# EAGLE design pc_sensything_v1 (EAGLE 6.6.0)

## Sheet 1 of 2
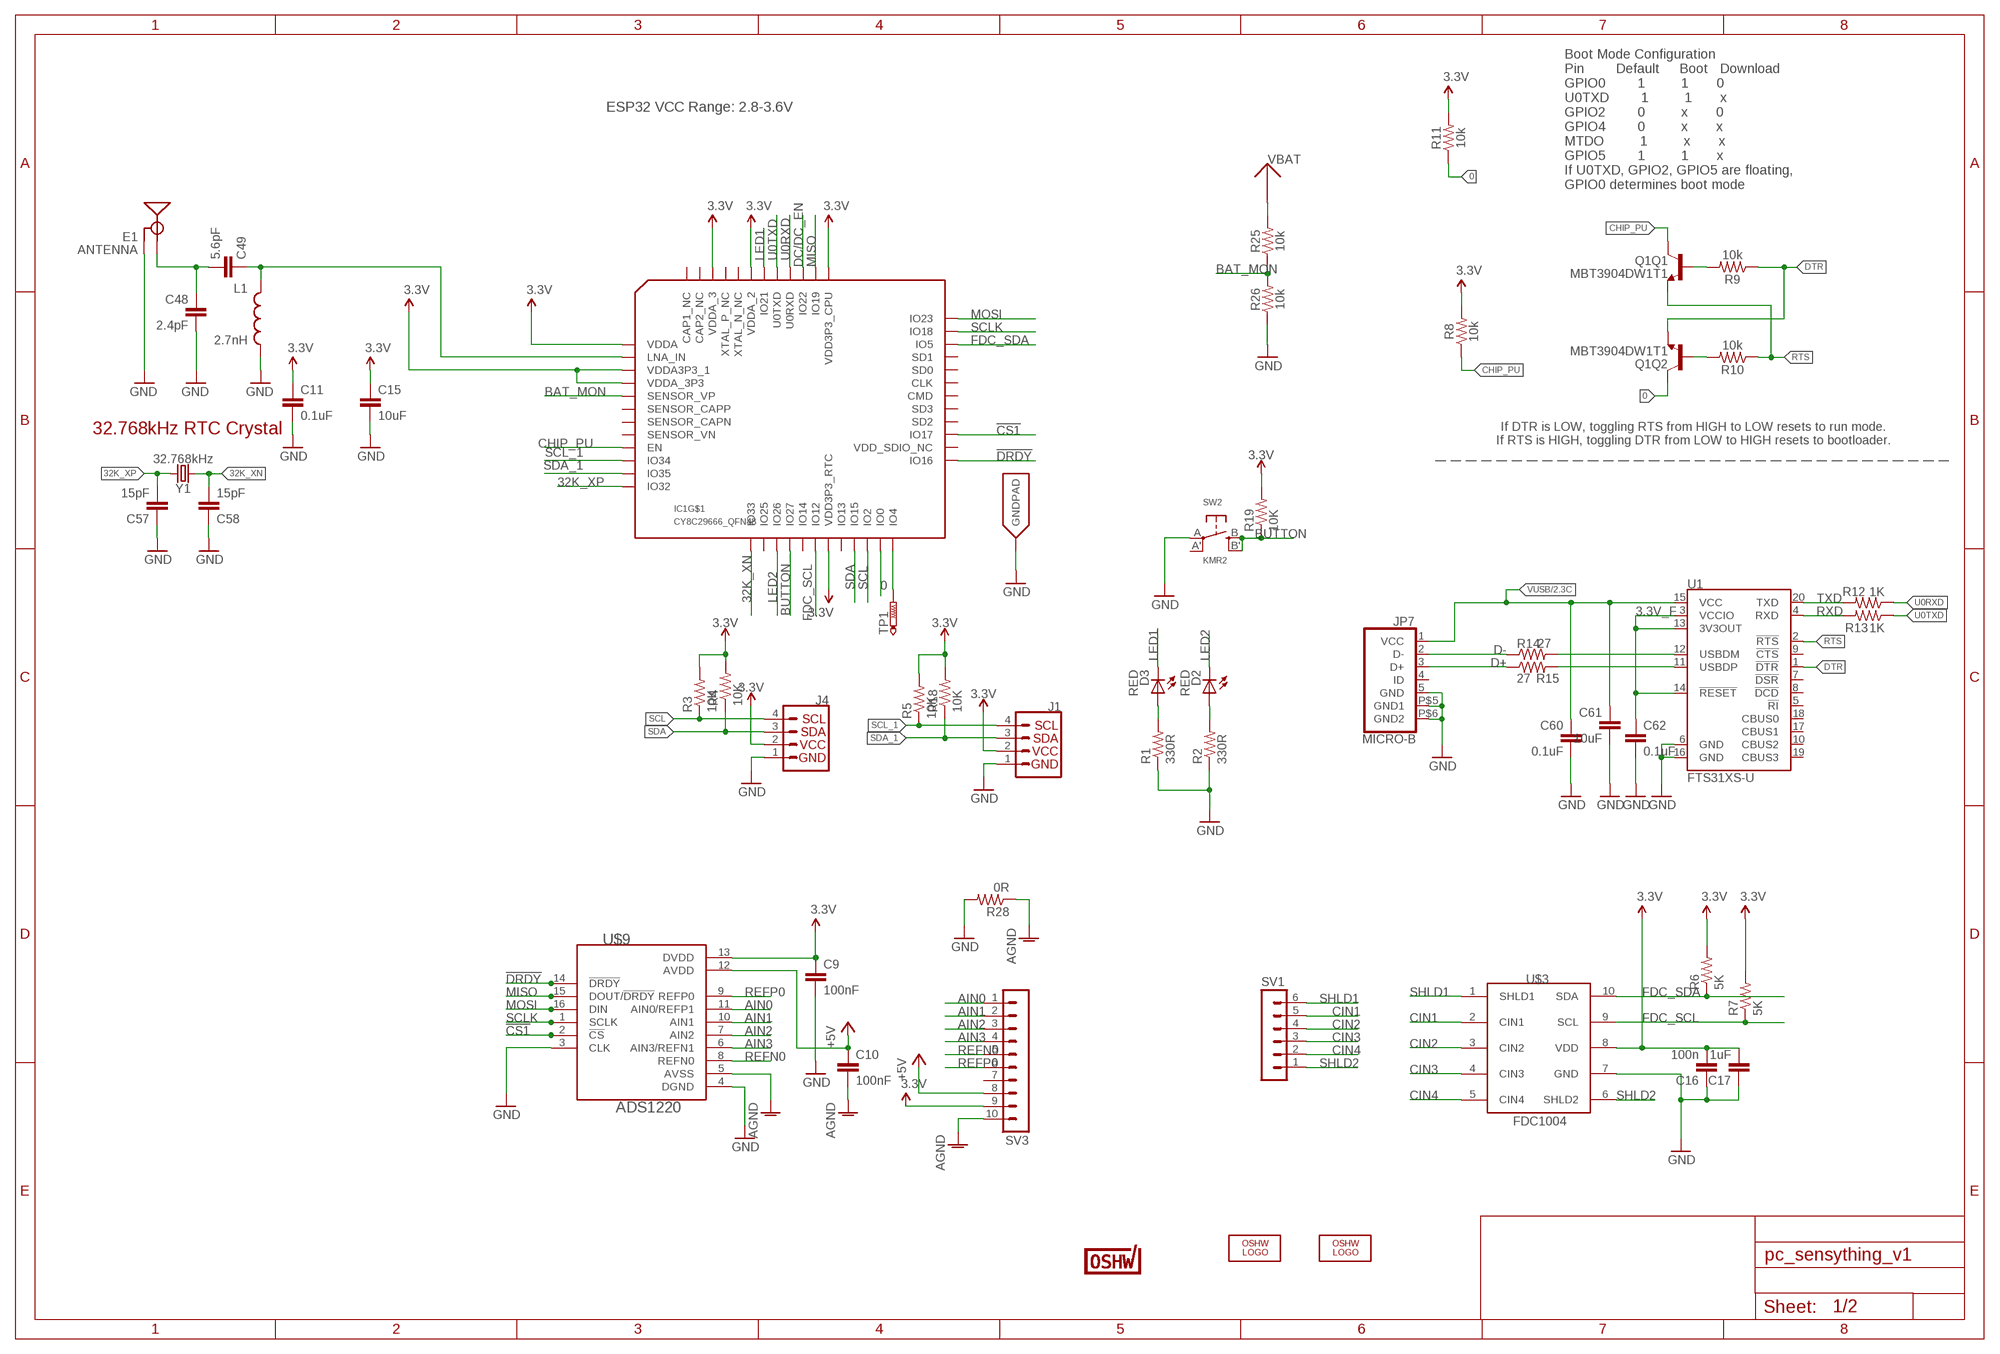
[diagram p0: schematic, sheet 1]

### Parts
C9  100nF  C-EUC0805  [C0805]
C10  100nF  C-EUC0805  [C0805]
C11  0.1uF  0.1UF-0603-25V-(+80/-20%)  [0603]
C15  10uF  10UF-0603-6.3V-20%  [0603]
C16  100n  C-EUC0805  [C0805]
C17  1uF  C-EUC0805  [C0805]
C48  2.4pF  2.4PF-0603-50V-5%  [0603]
C49  5.6pF  5.6PF-50V-5%(0603)  [0603]
C57  15pF  15PF-0603-50V-5%  [0603]
C58  15pF  15PF-0603-50V-5%  [0603]
C60  0.1uF  C-EUC0402  [C0402]
C61  10uF  C-EUC0805  [C0805]
C62  0.1uF  C-EUC0402  [C0402]
D2  RED  LEDCHIPLED_0603  [CHIPLED_0603]
D3  RED  LEDCHIPLED_0603  [CHIPLED_0603]
E1  ANTENNA  ANTENNATRACE-TUNED  [TRACE_ANTENNA_2.4GHZ_25.7MM_TUNED]
IC1  CY8C29666_QFN48  [QFN48]
J1  QWIIC_CONNECTORJS-1MM  [1X04_1MM_RA]
J4  QWIIC_CONNECTORJS-1MM  [1X04_1MM_RA]
JP7  MICRO-B  [MICRO-B]
L1  2.7nH  INDUCTOR0603  [0603]
LOGO2  OSHW_LOGO_FILLX0200-NT  [OSHW_FILLX200_NOTEXT]
LOGO3  OSHW_LOGO_FILLX0200-NT  [OSHW_FILLX200_NOTEXT]
Q1  MBT3904DW1T1  [SC70-6]
R1  330R  R-US_R0402  [R0402]
R2  330R  R-US_R0402  [R0402]
R3  10K  R-US_R0402  [R0402]
R4  10K  R-US_R0402  [R0402]
R5  10K  R-US_R0402  [R0402]
R6  5K  R-US_R0805  [R0805]
R7  5K  R-US_R0805  [R0805]
R8  10k  10KOHM-1/10W-1%(0603)0603  [0603]
R9  10k  10KOHM-0603-1/10W-1%  [0603]
R10  10k  10KOHM-0603-1/10W-1%  [0603]
R11  10k  10KOHM-1/10W-1%(0603)0603  [0603]
R12  1K  R-US_R0402  [R0402]
R13  1K  R-US_R0402  [R0402]
R14  27  R-US_R0402  [R0402]
R15  27  R-US_R0402  [R0402]
R18  10K  R-US_R0402  [R0402]
R19  10K  R-US_R0402  [R0402]
R25  10k  10KOHM-1/10W-1%(0603)0603  [0603]
R26  10k  10KOHM-1/10W-1%(0603)0603  [0603]
R28  0R  R-US_R0805  [R0805]
SV1  MA06-1  [MA06-1]
SV3  MA10-1  [MA10-1]
SW2  KMR2  SWITCH_TACT_SMT4.6X2.8  [BTN_KMR2_4.6X2.8]
TP1  PTR1TP10SQ  [TP10SQ]
U1  FTS31XS-U  FT231XS  [SSOP20_L]
U$3  FDC1004  [VSSOP-10]
U$9  ADS1220  [TSSOP-16]
U$22  CERT-SMALL  [CERT-SMALL-SILK]
Y1  32.768kHz  CRYSTAL-32.768KHZSMD-3.2X1.5  [CRYSTAL-SMD-3.2X1.5MM]

### Nets
0: IC1.23(IO0) Q1.6(Q2:C) R11.1
3.3V: C9.1 C11.1 C15.1 C16.2 C17.2 IC1.1(VDDA) IC1.3(VDDA3P3_1) IC1.4(VDDA_3P3) IC1.19(VDD3P3_RTC) IC1.37(VDD3P3_CPU) IC1.43(VDDA_2) IC1.46(VDDA_3) J1.2 J4.2 R3.2 R4.2 R5.2 R6.2 R7.2 R8.2 R11.2 R18.2 R19.2 SV3.9 U$3.8(VDD) U$9.13(DVDD) ; also sheet 2
3.3V_F: C62.1 U1.3(VCCIO) U1.13(3V3OUT) U1.14(!RESET)
32K_XN: C58.2 IC1.13(IO33) Y1.P$2
32K_XP: C57.2 IC1.12(IO32) Y1.P$1
!CS1: IC1.27(IO17) U$9.2(!CS)
!DRDY: IC1.25(IO16) U$9.14(!DRDY)
+5V: C10.1 SV3.8 U$9.12(AVDD) ; also sheet 2
AGND: C10.2 R28.1 SV3.10 U$9.5(AVSS)
AIN0: SV3.1 U$9.11(AIN0/REFP1)
AIN1: SV3.2 U$9.10(AIN1)
AIN2: SV3.3 U$9.7(AIN2)
AIN3: SV3.4 U$9.6(AIN3/REFN1)
BAT_MON: IC1.5(SENSOR_VP) R25.1 R26.2
BUTTON: IC1.16(IO27) R19.1 SW2.B'(S1) SW2.B(S)
CHIP_PU: IC1.9(EN) Q1.3(Q1:C) R8.1
CIN1: SV1.5 U$3.2(CIN1)
CIN2: SV1.4 U$3.3(CIN2)
CIN3: SV1.3 U$3.4(CIN3)
CIN4: SV1.2 U$3.5(CIN4)
D+: JP7.3(D+) R15.1
D-: JP7.2(D-) R14.1
DC/DC_EN: IC1.39(IO22) ; also sheet 2
DTR: Q1.1(Q2:E) R9.1 U1.1(!DTR)
FDC_SCL: IC1.18(IO12) R7.1 U$3.9(SCL)
FDC_SDA: IC1.34(IO5) R6.1 U$3.10(SDA)
GND: C9.2 C11.2 C15.2 C16.1 C17.1 C48.2 C57.1 C58.1 C60.2 C61.2 C62.2 E1.GND E1.GND2(GND) IC1.EXP(GNDPAD) J1.1 J4.1 JP7.5(GND) JP7.P$5(GND1) JP7.P$6(GND2) L1.2 R1.1 R2.1 R26.1 R28.2 SW2.A(P) U1.6(GND) U1.16(GND) U$3.7(GND) U$9.3(CLK) U$9.4(DGND) ; also sheet 2
LED1: D3.C IC1.42(IO21)
LED2: D2.C IC1.15(IO26)
LNA_IN: C49.1 IC1.2(LNA_IN) L1.1
MISO: IC1.38(IO19) U$9.15(DOUT/!DRDY)
MOSI: IC1.36(IO23) U$9.16(DIN)
N$3: D3.A R1.2
N$4: Q1.5(Q1:B) R9.2
N$5: D2.A R2.2
N$8: IC1.24(IO4) TP1.TP
N$9: Q1.2(Q2:B) R10.2
N$20: R14.2 U1.12(USBDM)
N$21: R15.2 U1.11(USBDP)
REFN0: SV3.5 U$9.8(REFN0)
REFP0: SV3.6 U$9.9(REFP0)
RTS: Q1.4(Q1:E) R10.1 U1.2(!RTS)
RXD: R13.2 U1.4(RXD)
SCL: IC1.22(IO2) J4.4 R3.1
SCL_1: IC1.10(IO34) J1.4 R5.1
SCLK: IC1.35(IO18) U$9.1(SCLK)
SDA: IC1.21(IO15) J4.3 R4.1
SDA_1: IC1.11(IO35) J1.3 R18.1
SHLD1: SV1.6 U$3.1(SHLD1)
SHLD2: SV1.1 U$3.6(SHLD2)
TRACE_ANT2: C48.1 C49.2 E1.ANT(SIGNAL)
TXD: R12.2 U1.20(TXD)
U0RXD: IC1.40(U0RXD) R12.1
U0TXD: IC1.41(U0TXD) R13.1
VBAT: R25.2 ; also sheet 2
VUSB: C60.1 C61.1 JP7.1(VCC) U1.15(VCC) ; also sheet 2
Unconnected: IC1.6(SENSOR_CAPP) IC1.8(SENSOR_VN) IC1.14(IO25) IC1.17(IO14) IC1.20(IO13) IC1.26(VDD_SDIO_NC) IC1.28(SD2) IC1.29(SD3) IC1.30(CMD) IC1.31(CLK) IC1.32(SD0) IC1.33(SD1) IC1.44(XTAL_N_NC) IC1.45(XTAL_P_NC) IC1.47(CAP2_NC) IC1.48(CAP1_NC) JP7.4(ID) SV3.7 SW2.A'(P1) U1.5(!RI) U1.7(!DSR) U1.8(!DCD) U1.9(!CTS) U1.10(CBUS2) U1.17(CBUS1) U1.18(CBUS0) U1.19(CBUS3)

### Notes on the sheet
- ESP32 VCC Range: 2.8-3.6V
- Boot Mode Configuration
  Pin        Default     Boot   Download
  GPIO0        1         1       0
  U0TXD        1         1       x
  GPIO2        0         x       0
  GPIO4        0         x       x
  MTDO         1         x       x
  GPIO5        1         1       x
  If U0TXD, GPIO2, GPIO5 are floating, 
  GPIO0 determines boot mode
- 32.768kHz RTC Crystal
- If DTR is LOW, toggling RTS from HIGH to LOW resets to run mode.
  If RTS is HIGH, toggling DTR from LOW to HIGH resets to bootloader.

## Sheet 2 of 2
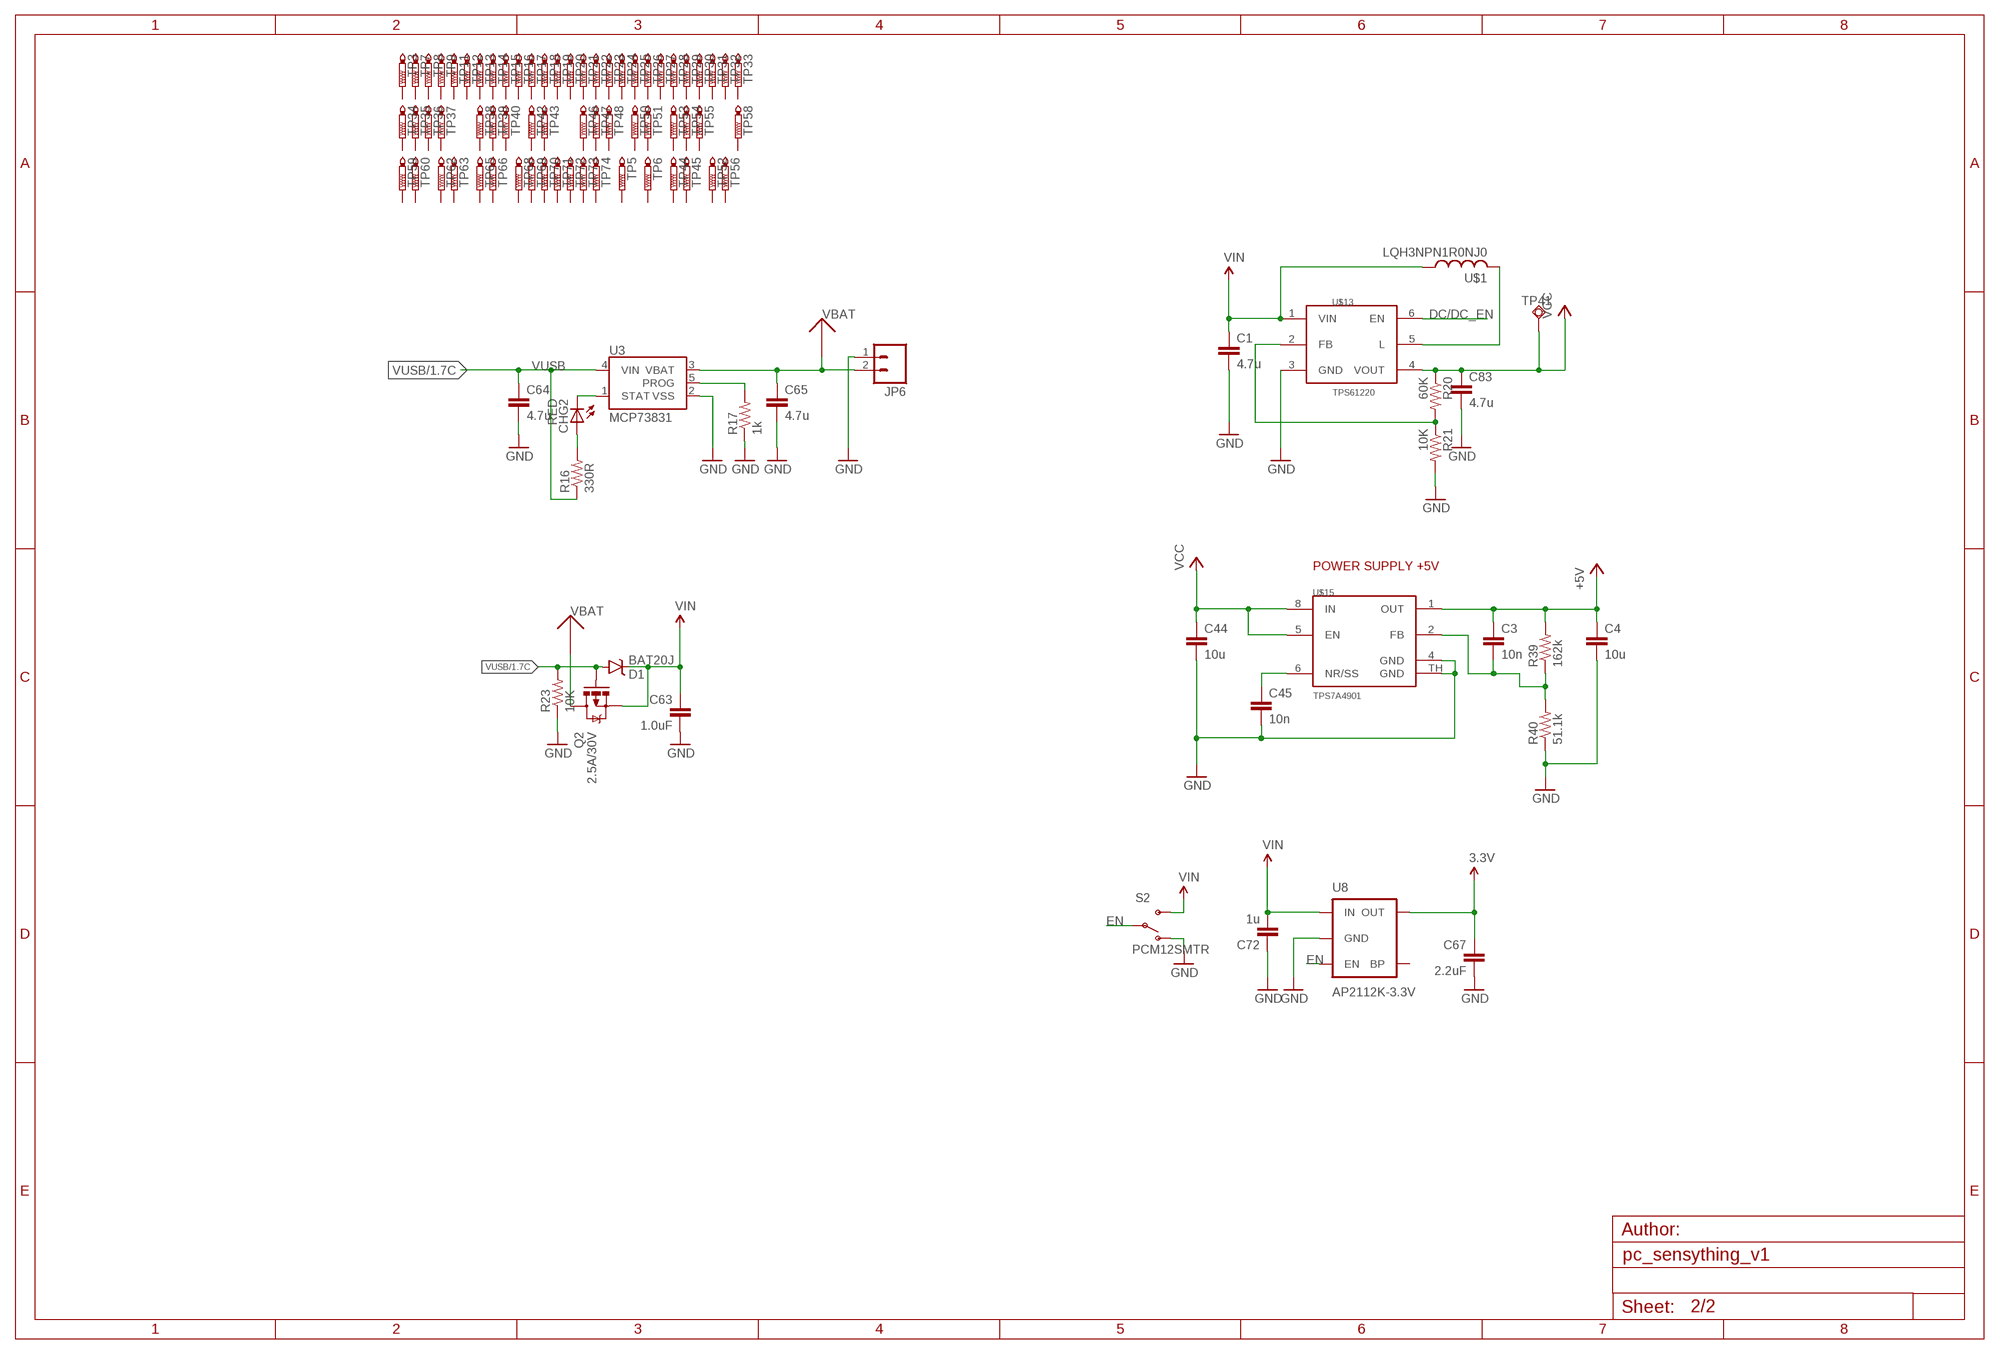
[diagram p1: schematic, sheet 2]

### Parts
C1  4.7u  C-EUC0805  [C0805]
C3  10n  C-EUC0402  [C0402]
C4  10u  C-EUC0805  [C0805]
C44  10u  C-EUC0805  [C0805]
C45  10n  C-EUC0402  [C0402]
C63  1.0uF  C-EUC0402  [C0402]
C64  4.7u  C-EUC0805  [C0805]
C65  4.7u  C-EUC0805  [C0805]
C67  2.2uF  C-EUC0402  [C0402]
C72  1u  C-EUC0402  [C0402]
C83  4.7u  C-EUC0805  [C0805]
CHG2  RED  LEDCHIPLED_0603  [CHIPLED_0603]
D1  BAT20J  DIODE-SCHOTTKY-BAT20J  [SOD-323]
JP6  M02-JST-2MM-SMT  [JST-2-SMD]
Q2  2.5A/30V  MOSFET-PCHANNELDMG2307L  [SOT23-3]
R16  330R  R-US_R0402  [R0402]
R17  1k  R-US_R0402  [R0402]
R20  60K  R-US_R0805  [R0805]
R21  10K  R-US_R0805  [R0805]
R23  10K  R-US_R0402  [R0402]
R39  162k  R-US_R0805  [R0805]
R40  51.1k  R-US_R0805  [R0805]
S2  PCM12SMTR  SWITCH-SPDT-SMD-A  [SWITCH-SPST-SMD-A]
TP3  PTR1PAD1-13  [P1-13]
TP5  PTR1PAD1-13  [P1-13]
TP6  PTR1PAD1-13  [P1-13]
TP7  PTR1PAD1-13  [P1-13]
TP8  PTR1PAD1-13  [P1-13]
TP9  PTR1PAD1-13  [P1-13]
TP11  PTR1PAD1-13  [P1-13]
TP12  PTR1PAD1-13  [P1-13]
TP13  PTR1PAD1-13  [P1-13]
TP14  PTR1PAD1-13  [P1-13]
TP15  PTR1PAD1-13  [P1-13]
TP16  PTR1PAD1-13  [P1-13]
TP17  PTR1PAD1-13  [P1-13]
TP18  PTR1PAD1-13  [P1-13]
TP19  PTR1PAD1-13  [P1-13]
TP20  PTR1PAD1-13  [P1-13]
TP21  PTR1PAD1-13  [P1-13]
TP22  PTR1PAD1-13  [P1-13]
TP23  PTR1PAD1-13  [P1-13]
TP24  PTR1PAD1-13  [P1-13]
TP25  PTR1PAD1-13  [P1-13]
TP26  PTR1PAD1-13  [P1-13]
TP27  PTR1PAD1-13  [P1-13]
TP28  PTR1PAD1-13  [P1-13]
TP29  PTR1PAD1-13  [P1-13]
TP30  PTR1PAD1-13  [P1-13]
TP31  PTR1PAD1-13  [P1-13]
TP32  PTR1PAD1-13  [P1-13]
TP33  PTR1PAD1-13  [P1-13]
TP34  PTR1PAD1-13  [P1-13]
TP35  PTR1PAD1-13  [P1-13]
TP36  PTR1PAD1-13  [P1-13]
TP37  PTR1PAD1-13  [P1-13]
TP38  PTR1PAD1-13  [P1-13]
TP39  PTR1PAD1-13  [P1-13]
TP40  PTR1PAD1-13  [P1-13]
TP41  TPSQB1,27  [B1,27]
TP42  PTR1PAD1-13  [P1-13]
TP43  PTR1PAD1-13  [P1-13]
TP44  PTR1PAD1-13  [P1-13]
TP45  PTR1PAD1-13  [P1-13]
TP46  PTR1PAD1-13  [P1-13]
TP47  PTR1PAD1-13  [P1-13]
TP48  PTR1PAD1-13  [P1-13]
TP50  PTR1PAD1-13  [P1-13]
TP51  PTR1PAD1-13  [P1-13]
TP52  PTR1PAD1-13  [P1-13]
TP53  PTR1PAD1-13  [P1-13]
TP54  PTR1PAD1-13  [P1-13]
TP55  PTR1PAD1-13  [P1-13]
TP56  PTR1PAD1-13  [P1-13]
TP58  PTR1PAD1-13  [P1-13]
TP59  PTR1PAD1-13  [P1-13]
TP60  PTR1PAD1-13  [P1-13]
TP62  PTR1PAD1-13  [P1-13]
TP63  PTR1PAD1-13  [P1-13]
TP65  PTR1PAD1-13  [P1-13]
TP66  PTR1PAD1-13  [P1-13]
TP68  PTR1PAD1-13  [P1-13]
TP69  PTR1PAD1-13  [P1-13]
TP70  PTR1PAD1-13  [P1-13]
TP71  PTR1PAD1-13  [P1-13]
TP72  PTR1PAD1-13  [P1-13]
TP73  PTR1PAD1-13  [P1-13]
TP74  PTR1PAD1-13  [P1-13]
U3  MCP73831  [SOT23-5]
U8  AP2112K-3.3V  V_REG_LDOSMD  [SOT23-5]
U$1  LQH3NPN1R0NJ0  [LQH3NP]
U$13  TPS61220  TPS61222  [SC-70-6]
U$15  TPS7A4901  [S-PDSO-G08]

### Nets
3.3V: C67.1 U8.5(OUT) ; also sheet 1
+5V: C3.1 C4.1 R39.2 U$15.1(OUT) ; also sheet 1
DC/DC_EN: U$13.6(EN) ; also sheet 1
EN: S2.2(P) U8.3(EN)
GND: C1.2 C4.2 C44.2 C45.2 C63.2 C64.2 C65.2 C67.2 C72.1 C83.2 JP6.1 R17.1 R21.2 R23.1 R40.1 S2.1(O) U3.2(VSS) U8.2(GND) U$13.3(GND) U$15.4(GND) U$15.TH(GND) ; also sheet 1
N$22: CHG2.C U3.1(STAT)
N$25: R20.2 R21.1 U$13.2(FB)
N$26: C45.1 U$15.6(NR/SS)
N$27: C3.2 R39.1 R40.2 U$15.2(FB)
N$29: CHG2.A R16.2
N$31: R17.2 U3.5(PROG)
N$39: U$1.P$2 U$13.5(L)
VBAT: C65.1 JP6.2 Q2.3(D) U3.3(VBAT) ; also sheet 1
VCC: C44.1 C83.1 R20.1 TP41.TP U$13.4(VOUT) U$15.5(EN) U$15.8(IN)
VIN: C1.1 C63.1 C72.2 D1.C Q2.2(S) S2.3(S) U8.1(IN) U$1.P$1 U$13.1(VIN)
VUSB: C64.1 D1.A Q2.1(G) R16.1 R23.2 U3.4(VIN) ; also sheet 1
Unconnected: TP3.TP TP5.TP TP6.TP TP7.TP TP8.TP TP9.TP TP11.TP TP12.TP TP13.TP TP14.TP TP15.TP TP16.TP TP17.TP TP18.TP TP19.TP TP20.TP TP21.TP TP22.TP TP23.TP TP24.TP TP25.TP TP26.TP TP27.TP TP28.TP TP29.TP TP30.TP TP31.TP TP32.TP TP33.TP TP34.TP TP35.TP TP36.TP TP37.TP TP38.TP TP39.TP TP40.TP TP42.TP TP43.TP TP44.TP TP45.TP TP46.TP TP47.TP TP48.TP TP50.TP TP51.TP TP52.TP TP53.TP TP54.TP TP55.TP TP56.TP TP58.TP TP59.TP TP60.TP TP62.TP TP63.TP TP65.TP TP66.TP TP68.TP TP69.TP TP70.TP TP71.TP TP72.TP TP73.TP TP74.TP U8.4(BP)

### Notes on the sheet
- POWER SUPPLY +5V

## Power pins joined to a net without a drawn wire
SENSOR_CAPN: IC1.7(SENSOR_CAPN)

## Library data of the parts
C1 C3 C4 C9 C10 C16 C17 C44 C45 C60-C65 C67 C72 C83 = rcl:C-EU: CAPACITOR, European symbol
C11 = SparkFun-Capacitors:0.1UF: 0.1µF ceramic capacitors A capacitor is a passive two-terminal electrical component used to store electrical energy temporarily in an electric field.; PROD_ID: CAP-00810
C15 = SparkFun-Capacitors:10UF: 10.0µF ceramic capacitors A capacitor is a passive two-terminal electrical component used to store electrical energy temporarily in an electric field.; PROD_ID: CAP-11015
C48 = esp32-thing-temp:2.4PF: 2.4pF ceramic capacitors A capacitor is a passive two-terminal electrical component used to store electrical energy temporarily in an electric field.; PROD_ID: CAP-13541
C49 = esp32-thing-temp:5.6PF-50V-5%(0603): CAP-12456; PROD_ID: CAP-12456
C57 C58 = SparkFun-Capacitors:15PF: 15pF ceramic capacitors A capacitor is a passive two-terminal electrical component used to store electrical energy temporarily in an electric field.; PROD_ID: CAP-07881
CHG2 D2 D3 = led:LED: LED OSRAM: - CHIPLED LG R971, LG N971, LY N971, LG Q971, LY Q971, LO R971, LY R971 LH N974, LH R974 LS Q976, LO Q976, LY Q976 LO Q996 - Hyper CHIPLED LW Q18S LB Q993, LB Q99A, LB R99A - SideLED LS A670, LO A670, LY A670, LG A670, LP A670 LB A673, LV A673, LT A673, LW A673 LH A674 LY A675 LS A676, LA A676, LO A676, LY A676, LW A676 LS A679, LY A679, LG A679 - Hyper Micro SIDELED® LS Y876, LA Y876, LO Y876, LY Y876 LT Y87S - SmartLED LW L88C, LW L88S LB L89C, LB L89S, LG L890 LS L89K, LO L89K, LY L89K LS L896, LA L896, LO L896, LY L896 - TOPLED LS T670, LO T670, LY T670, LG T670, LP T670 LSG T670, LSP T670, LSY T670, LOP T670, LYG T670 LG T671, LOG T671, LSG T671 LB T673, LV T673, LT T673, LW T673 LH T674 LS T676, LA T676, LO T676, LY T676, LB T676, LH T676, LSB T676, LW T676 LB T67C, LV T67C, LT T67C, LS T67K, LO T67K, LY T67K, LW E67C LS E67B, LA E67B, LO E67B, LY E67B, LB E67C, LV E67C, LT E67C LW T67C LS T679, LY T679, LG T679 LS T770, LO T770, LY T770, LG T770, LP T770 LB T773, LV T773, LT T773, LW T773 LH T774 LS E675, LA E675, LY E675, LS T675 LS T776, LA T776, LO T776, LY T776, LB T776 LHGB T686 LT T68C, LB T68C - Hyper Mini TOPLED® LB M676 - Mini TOPLED Santana® LG M470 LS M47K, LO M47K, LY M47K Source: http://www.osram.convergy.de LUXEON: - LUMILED® LXK2-PW12-R00, LXK2-PW12-S00, LXK2-PW14-U00, LXK2-PW14-V00 LXK2-PM12-R00, LXK2-PM12-S00, LXK2-PM14-U00 LXK2-PE12-Q00, LXK2-PE12-R00, LXK2-PE12-S00, LXK2-PE14-T00, LXK2-PE14-U00 LXK2-PB12-K00, LXK2-PB12-L00, LXK2-PB12-M00, LXK2-PB14-N00, LXK2-PB14-P00, LXK2-PB14-Q00 LXK2-PR12-L00, LXK2-PR12-M00, LXK2-PR14-Q00, LXK2-PR14-R00 LXK2-PD12-Q00, LXK2-PD12-R00, LXK2-PD12-S00 LXK2-PH12-R00, LXK2-PH12-S00 LXK2-PL12-P00, LXK2-PL12-Q00, LXK2-PL12-R00 Source: www.luxeon.com KINGBRIGHT: KA-3528ASYC Source: www.kingbright.com
D1 = SparkFun-DiscreteSemi:DIODE-SCHOTTKY: Schottky diodes in SFE's production catalog BAT20J 1A 23V 0.62Vf RB751 120mA 40V 0.37Vf PMEG4005EJ 0.5A 40V 0.42Vf MBRA140 1A 40V 0.5Vf B340A 3A 40V SMA; PROD_ID: DIO-11623
E1 = esp32-thing-temp:ANTENNA: Chip antenna Chip antenna with ground or secondary connection. Common with larger metal RF connectors.
IC1 = cypresspsoc_0.30:CY8C29666_QFN48
J1 J4 = SparkFun-Connectors:QWIIC_CONNECTOR: SparkFun I2C Standard Qwiic Connector An SMD 1mm pitch JST connector makes it easy and quick (get it? Qwiic?) to connect I2C devices to each other. The Qwiic system <http://www.sparkfun.com/qwiic> enables fast and solderless connection between popular platforms and various sensors and actuators. We carry 200mm <https://www.sparkfun.com/products/14204>, 100mm <https://www.sparkfun.com/products/14205>, 50mm <https://www.sparkfun.com/products/14206>, and breadboard friendly <https://www.sparkfun.com/products/14207> Qwiic cables. We also offer 10 pcs strips <https://www.sparkfun.com/products/14323> the SMD connectors.; PROD_ID: CONN-13694
JP6 = SparkFun:M02: Header 2 Standard 2-pin 0.1" header. Use with straight break away headers (SKU : PRT-00116), right angle break away headers (PRT-00553), swiss pins (PRT-00743), machine pins (PRT-00117), and female headers (PRT-00115). Molex polarized connector foot print use with SKU : PRT-08233 with associated crimp pins and housings.
JP7 = circuitects:MICRO-B
L1 = SparkFun-Passives:INDUCTOR: Inductors Basic Inductor/Choke - 0603 and 1206. Footprints are not proven and vary greatly between part numbers. INDUCTOR POWER 3.3UH 4.0A SMD 0.197" L x 0.197" W x 0.177" H (5.00mm x 5.00mm x 4.50mm); PROD_ID: NDUC-08762
LOGO2 LOGO3 = ohw-logo:OSHW_LOGO_FILL
Q1 = esp32-thing-temp:MBT3904DW1T1: MBT3904DW1 Dual NPN Transistors The MBT3904W1 puts two general purpose 3904 NPN transistors in a single package. Datasheet <http://www.onsemi.com/pub_link/Collateral/MBT3904DW1T1-D.PDF>; PROD_ID: TRANS-13337
Q2 = SparkFun-DiscreteSemi:MOSFET-PCHANNEL: Generic PMOSFET IRLML2244 - TRANS-11153 (SOT-23 -20V -4.3A) (1.Gate 2.Source 3.Drain) FQP27P06 - COM-10349 <http://www.sparkfun.com/products/10349> (TO-220 -60V -27A) (1.Gate 2.Source 3.Drain); PROD_ID: TRANS-11308
R1-R7 R12-R21 R23 R28 R39 R40 = rcl:R-US_: RESISTOR, American symbol
R8 R11 R25 R26 = SparkFun-Resistors:10KOHM-1/10W-1%(0603): RES-00824; PROD_ID: RES-00824; VALUE: 10K
R9 R10 = SparkFun-Resistors:10KOHM: 10kΩ resistor A resistor is a passive two-terminal electrical component that implements electrical resistance as a circuit element. Resistors act to reduce current flow, and, at the same time, act to lower voltage levels within circuits. - Wikipedia; PROD_ID: RES-00824
S2 = SparkFun-Electromechanical:SWITCH-SPDT: SPDT Switch Simple slide switch, Spark Fun Electronics SKU : COM-00102 DPDT SMT slide switch, AYZ0202, SWCH-08179; PROD_ID: SWCH-10651
SV1 = con-lstb:MA06-1: PIN HEADER; OC_FARNELL: unknown; OC_NEWARK: unknown
SV3 = con-lstb:MA10-1: PIN HEADER; OC_FARNELL: unknown; OC_NEWARK: unknown
SW2 = microbuilder:SWITCH_TACT_SMT: SMT Tact Switches 6x6mm - Digikey: P12940SCT-ND KMR2 (4.6x2.8mm) - Digikey: 401-1426-1-ND EVQ-PQHB55 - Light Touch, 160GF (4.5x4.5mm) - Digikey: P8090SCT-ND KMT0 - KMT021 NGJ LHS (etc.) IP68/Waterproof - Digikey: CKN10289CT-ND
TP1 TP3 TP5-TP9 TP11-TP40 TP42-TP48 TP50-TP56 TP58-TP60 TP62 TP63 TP65 TP66 TP68-TP74 = testpad:PTR1: TEST PIN
TP41 = testpad:TPSQ: Test pad
U1 = SparkFun-DigitalIC:FT231X: FTDI FT231X Full Speed USB to Full-handshake UART This USB2.0 Full Speed IC offers a compact bridge to full handshake UART interfaces. The device is a UART, capable of operating up to 3MBaud, with low power consumption (8mA). The FT231X includes the complete FT-X series feature set and enables USB to be added into a system design quickly and easily over a UART interface.; PROD_ID: IC-11524; VALUE: FT231XS
U3 = SparkFun:MCP73831: Microchip's MCP73831 Miniature single cell, fully integrated Li-Ion, Li-polymer charge management controller http://ww1.microchip.com/downloads/en/DeviceDoc/21984a.pdf
U8 = SparkFun-PowerIC:V_REG_LDO: Voltage Regulator LDO Standard 150mA LDO voltage regulator in SOT-23 layout. Micrel part MIC5205. BP (by-pass) pin is used to lower output noise with 470pF cap.; PROD_ID: VREG-12457
U$1 = circuitects:LQH3NPN1R0NJ0
U$3 = circuitects:FDC1004
U$9 = circuitects:ADS1220
U$13 = circuitects:TPS61222
U$15 = circuitects:TPS7A4901
U$22 = OSHWA:CERT
Y1 = SparkFun-Clocks:CRYSTAL-32.768KHZ: 32.768kHz Crystal Frequency: 32.768kHz Frequency Stability: ±20ppm Load Capacitance: 12.5pF (PTH-2X6 & SMD-3.2X1.5), 6pF (SMD-2X6); PROD_ID: XTAL-13062

## Net classes
2 gnd: width 0.102 mm, drill 0.1 mm
4 USBpair: width 0.102 mm, drill 0.1 mm, clearance 0.15 mm to class 3

## Board
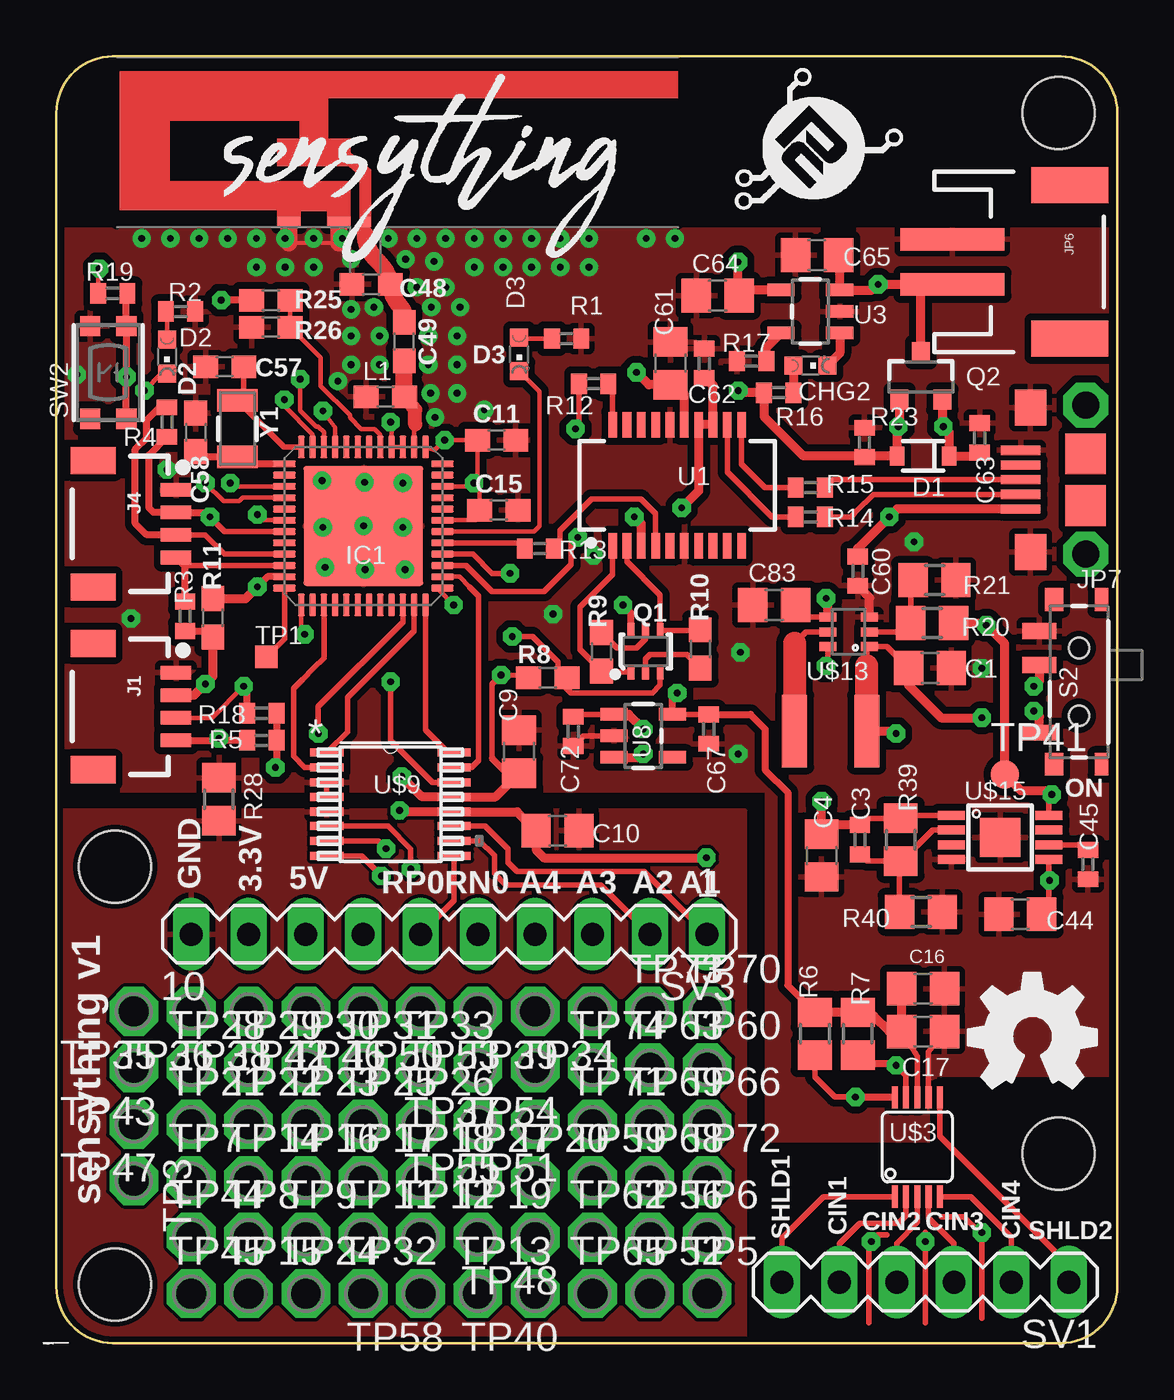
[diagram p2: board, top side]
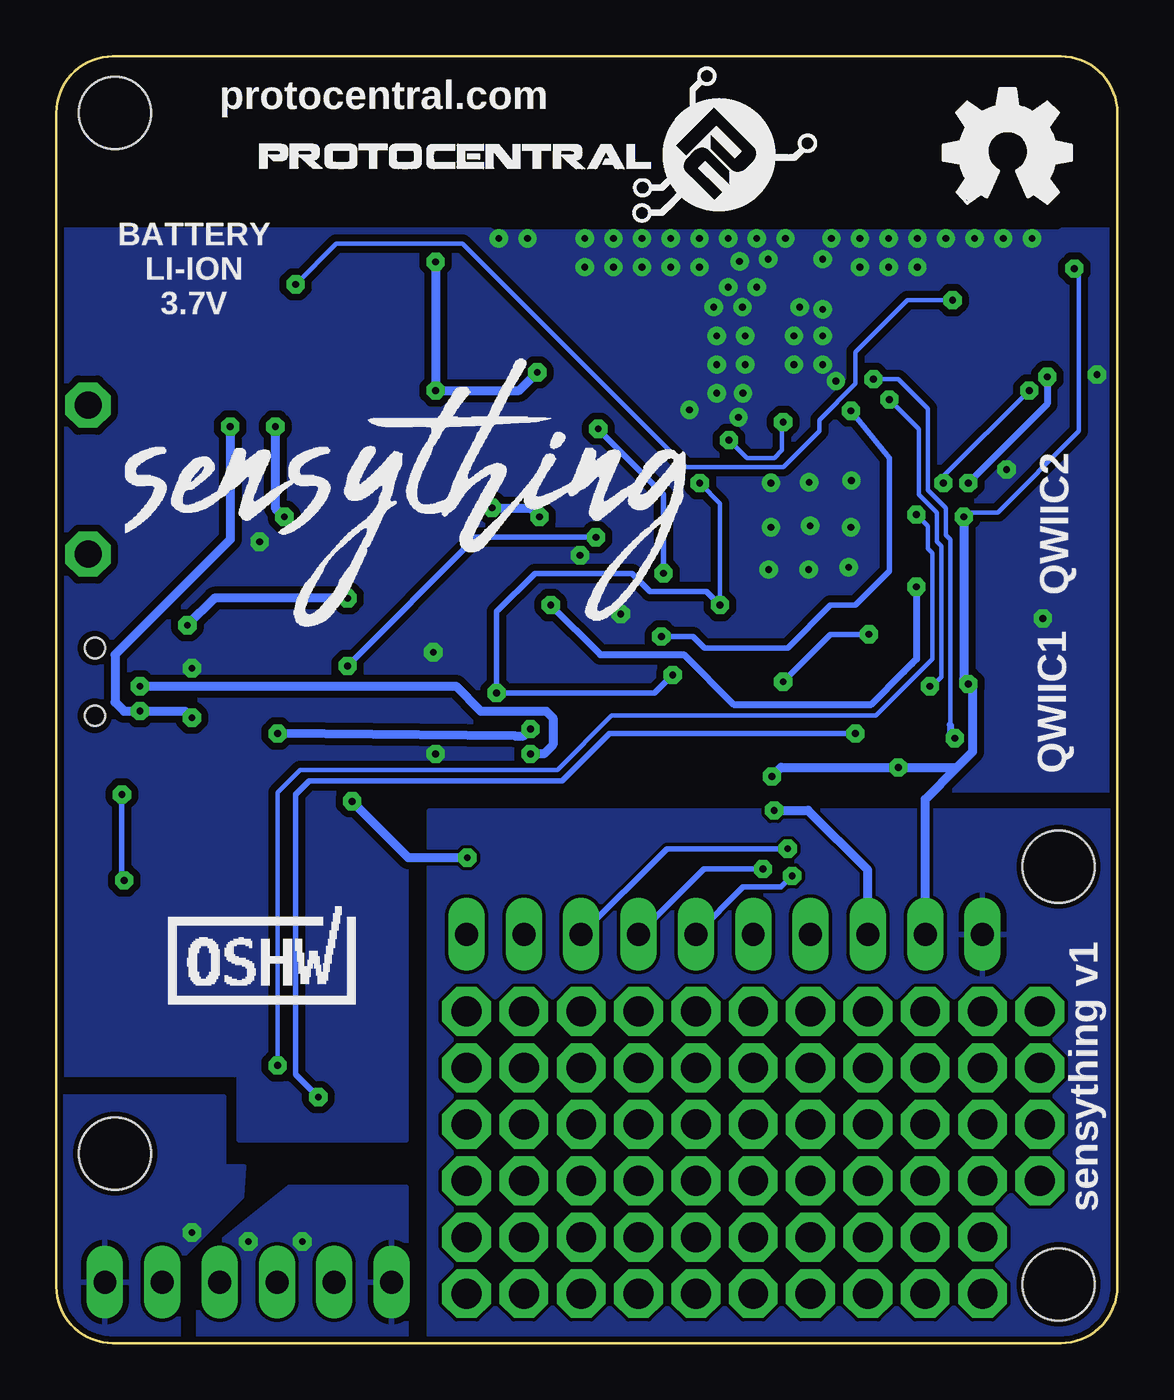
[diagram p3: board, bottom side, seen from below]

Size 47 x 57 mm. Coordinates in mm from the lower left corner, seen from the top.
Outline: 2.5,0 44.5,0 arc90 47,2.5 47,54.5 arc90 44.5,57 2.5,57 arc90 0,54.5 0,2.5 arc90 2.5,0
Copper layers (1*2*15*16): Top 0.035mm / dielectric 1.5mm / Route2 0.035mm / dielectric 0.15mm / Route15 0.035mm / dielectric 0.2mm / Bottom 0.035mm
Design rules "Circuitects-Rules": minimum track width 6mil, minimum drill 0.3mm, track to track 6mil, track to pad 6mil, pad to pad 6mil, via to via 6mil, smd to smd 6mil, copper to edge 10mil, drill to drill 8mil, minimum pad ring 12mil, minimum via ring 10mil, stop-mask expansion 4mil, vias tented up to drill 25mil, thermal gap 10mil
Holes 3.2 mm at 2.6,2.6 44.4,8.4 44.4,54.5 2.6,21.1

### Footprints (pad centres in the part's own frame; a part is rotated, then mirrored left to right if it is on the bottom)
C0805 = smd 1.3 x 1.5: 1 -0.95,0; 2 0.95,0
C0402 = smd 0.7 x 0.9: 1 -0.65,0; 2 0.65,0
0603 = smd 1.1 x 1: 1 -0.85,0; 2 0.85,0
CHIPLED_0603 = smd 0.8 x 0.8: A 0,-0.75; C 0,0.75
SOD-323 = smd 0.63 x 0.83: A 1.15,0; C -1.15,0
TRACE_ANTENNA_2.4GHZ_25.7MM_TUNED = smd 0.46 x 0.46: ANT 0,0.23 | smd 1 x 0.46: GND -1.18,0.23; GND2 -3.38,0.23
QFN48 = smd 1 x 0.3: 1 -3.5,2.75; 2 -3.5,2.25; 3 -3.5,1.75; 4 -3.5,1.25; 5 -3.5,0.75; 6 -3.5,0.25; 7 -3.5,-0.25; 8 -3.5,-0.75; 9 -3.5,-1.25; 10 -3.5,-1.75; 11 -3.5,-2.25; 12 -3.5,-2.75; 25 3.5,-2.75; 26 3.5,-2.25; 27 3.5,-1.75; 28 3.5,-1.25; 29 3.5,-0.75; 30 3.5,-0.25; 31 3.5,0.25; 32 3.5,0.75; 33 3.5,1.25; 34 3.5,1.75; 35 3.5,2.25; 36 3.5,2.75 | smd 0.3 x 1: 13 -2.75,-3.5; 14 -2.25,-3.5; 15 -1.75,-3.5; 16 -1.25,-3.5; 17 -0.75,-3.5; 18 -0.25,-3.5; 19 0.25,-3.5; 20 0.75,-3.5; 21 1.25,-3.5; 22 1.75,-3.5; 23 2.25,-3.5; 24 2.75,-3.5; 37 2.75,3.5; 38 2.25,3.5; 39 1.75,3.5; 40 1.25,3.5; 41 0.75,3.5; 42 0.25,3.5; 43 -0.25,3.5; 44 -0.75,3.5; 45 -1.25,3.5; 46 -1.75,3.5; 47 -2.25,3.5; 48 -2.75,3.5 | smd 5.309 x 5.309: EXP 0,0
1X04_1MM_RA = smd 0.6 x 1.35: 1 -1.5,0; 2 -0.5,0; 3 0.5,0; 4 1.5,0 | smd 1.2 x 2: NC1 2.8,-3.675; NC2 -2.8,-3.675
JST-2-SMD = smd 1 x 4.6: 1 -1,-3.7; 2 1,-3.7 | smd 1.6 x 3.4: NC1 -3.4,1.5; NC2 3.4,1.5
MICRO-B = smd 0.4 x 1.75: 1 -1.25,2.975; 2 -0.6,2.975; 3 0.05,2.975; 4 0.7,2.975; 5 1.35,2.975 | smd 1.8 x 1.8: P$1 -1.1,0.1; P$2 1.2,0.1 | drill 1.2 pad 2 octagon: P$3 -3.25,0.1; P$4 3.35,0.1 | smd 1.6 x 1.4: P$5 -3.15,2.55; P$6 3.25,2.55
SC70-6 = smd 0.3 x 0.66: 1 -0.65,-0.92; 2 0,-0.92; 3 0.65,-0.92; 4 0.65,0.92; 5 0,0.92; 6 -0.65,0.92
SOT23-3 = smd 0.8 x 0.9: 1 -0.95,-1; 2 0.95,-1; 3 0,1.1
R0402 = smd 0.7 x 0.9: 1 -0.65,0; 2 0.65,0
R0805 = smd 1.3 x 1.5: 1 -0.95,0; 2 0.95,0
SWITCH-SPST-SMD-A = smd 0.7 x 1.5: 1 -2.25,-1.75; 2 -0.75,-1.75; 3 2.25,-1.75 | smd 1 x 0.6: GND1 -3.65,1; GND3 3.65,1 | smd 1 x 0.8: GND2 -3.65,-1.1; GND4 3.65,-1.1 | hole 0.9: -1.5,0; 1.5,0
MA06-1 = drill 1.016 long: 1 -6.35,0; 2 -3.81,0; 3 -1.27,0; 4 1.27,0; 5 3.81,0; 6 6.35,0
MA10-1 = drill 1.016 long: 1 -11.43,0; 2 -8.89,0; 3 -6.35,0; 4 -3.81,0; 5 -1.27,0; 6 1.27,0; 7 3.81,0; 8 6.35,0; 9 8.89,0; 10 11.43,0
BTN_KMR2_4.6X2.8 = smd 0.9 x 0.9: A 2.05,0.8; A' -2.05,0.8; B 2.05,-0.8; B' -2.05,-0.8
TP10SQ = smd 1 x 1: TP 0,0
P1-13 = drill 1.321 pad 2.159 octagon: TP 0,0
B1,27 = smd 1.27 x 1.27: TP 0,0
SSOP20_L = smd 0.381 x 1.143: 1 -2.857,-2.68; 2 -2.223,-2.68; 3 -1.587,-2.68; 4 -0.953,-2.68; 5 -0.318,-2.68; 6 0.318,-2.68; 7 0.953,-2.68; 8 1.587,-2.68; 9 2.223,-2.68; 10 2.857,-2.68; 11 2.857,2.68; 12 2.223,2.68; 13 1.587,2.68; 14 0.953,2.68; 15 0.318,2.68; 16 -0.318,2.68; 17 -0.953,2.68; 18 -1.587,2.68; 19 -2.223,2.68; 20 -2.857,2.68
SOT23-5 = smd 0.55 x 1.2: 1 -0.95,-1.3; 2 0,-1.3; 3 0.95,-1.3; 4 0.95,1.3; 5 -0.95,1.3
LQH3NP = smd 1.1 x 3.2: P$1 -1.6,0; P$2 1.6,0
VSSOP-10 = smd 0.27 x 0.975: 1 -1,-2.2; 2 -0.5,-2.2; 3 0,-2.2; 4 0.5,-2.2; 5 1,-2.2; 6 1,2.2; 7 0.5,2.2; 8 0,2.2; 9 -0.5,2.2; 10 -1,2.2
TSSOP-16 = smd 1.473 x 0.356: 1 -2.819,2.656; 2 -2.819,1.996; 3 -2.819,1.335; 4 -2.819,0.7; 5 -2.819,0.04; 6 -2.819,-0.595; 7 -2.819,-1.256; 8 -2.819,-1.916; 9 2.819,-1.916; 10 2.819,-1.256; 11 2.819,-0.595; 12 2.819,0.04; 13 2.819,0.7; 14 2.819,1.335; 15 2.819,1.996; 16 2.819,2.656
SC-70-6 = smd 0.4 x 0.75: 1 -0.65,-0.925; 2 0,-0.925; 3 0.65,-0.925; 4 0.65,0.925; 5 0,0.925; 6 -0.65,0.925
S-PDSO-G08 = smd 0.4 x 1.2: 1 -0.975,-2.157; 2 -0.325,-2.157; 3 0.325,-2.157; 4 0.975,-2.157; 5 0.975,2.157; 6 0.325,2.157; 7 -0.325,2.157; 8 -0.975,2.157 | smd 1.73 x 1.78: TH 0,0
CRYSTAL-SMD-3.2X1.5MM = smd 1 x 1.8: P$1 -1.25,0; P$2 1.25,0

### Placement (x,y rotation side)
C1  38.7,29.9 0 top
C3  35.6,22.3 270 top
C4  33.9,21.6 270 top
C9  20.5,26.2 90 top
C10  22.2,22.7 0 top
C11  19.5,40 0 top
C15  19.6,36.9 0 top
C16  38.4,15.7 180 top
C17  38.4,13.8 180 top
C44  42.7,19 180 top
C45  45.7,21.2 270 top
C48  13.94,46.91 180 top
C49  15.41,44.37 90 top
C57  7.46,43.25 0 top
C58  6.17,40.34 270 top
C60  35.5,34.2 270 top
C61  27.2,43.4 90 top
C62  28.7,43.4 90 top
C63  40.9,40.1 90 top
C64  29.3,46.4 180 top
C65  33.7,48.2 180 top
C67  28.9,27.2 270 top
C72  22.9,27.1 90 top
C83  31.8,32.7 180 top
CHG2  33.4,43.3 270 top
D1  38.4,39.3 180 top
D2  4.9,43.7 180 top
D3  20.5,43.8 180 top
E1  13.69,49.45 0 top
IC1  13.6,36.2 270 top
J1  5.3,28.2 270 top
J4  5.3,36.3 270 top
JP6  43.4,47.9 270 top
JP7  45.7,38.2 90 top
L1  14.57,41.92 180 top
LOGO2  40.4,11.3 0 top
LOGO3  7.7,50.5 0 bottom
Q1  26.1,30.64 0 top
Q2  38.3,42.8 0 top
R1  22.6,44.5 180 top
R2  5.5,45.7 180 top
R3  5.7,32.2 270 top
R4  4.9,40.8 270 top
R5  9.1,26.7 0 top
R6  33.6,13.7 90 top
R7  35.5,13.7 90 top
R8  21.77,29.48 180 top
R9  24.15,30.63 90 top
R10  28.53,30.75 270 top
R11  6.93,32.13 270 top
R12  23.8,42.5 0 top
R13  21.4,35.2 0 top
R14  33.4,36.6 180 top
R15  33.4,37.9 180 top
R16  32,42.1 0 top
R17  30.8,43.5 0 top
R18  9.1,27.9 0 top
R19  2.5,46.5 180 top
R20  38.8,31.9 180 top
R21  38.9,33.8 0 top
R23  35.8,39.9 270 top
R25  9.5,46.2 180 top
R26  9.5,45 0 top
R28  7.2,24.09 90 top
R39  37.4,22.3 90 top
R40  38.3,19.1 180 top
S2  45.3,29.29 270 top
SV1  38.5,2.7 180 top
SV3  17.4,18.11 180 top
SW2  2.3,43 90 top
TP1  9.3,30.4 0 top
TP3  3.43,7.19 270 top
TP5  28.83,2.19 0 top
TP6  28.83,4.69 0 top
TP7  5.97,7.19 0 top
TP8  8.51,4.69 0 top
TP9  11.05,4.69 0 top
TP11  13.59,4.69 0 top
TP12  16.13,4.69 0 top
TP13  18.67,2.19 0 top
TP14  8.51,7.19 0 top
TP15  8.51,2.19 0 top
TP16  11.05,7.19 0 top
TP17  13.59,7.19 0 top
TP18  16.13,7.19 0 top
TP19  18.67,4.69 0 top
TP20  21.21,7.19 0 top
TP21  5.97,9.69 0 top
TP22  8.51,9.69 0 top
TP23  11.05,9.69 0 top
TP24  11.05,2.19 0 top
TP25  13.59,9.69 0 top
TP26  16.13,9.69 0 top
TP27  18.67,7.19 0 top
TP28  5.97,12.19 0 top
TP29  8.51,12.19 0 top
TP30  11.05,12.19 0 top
TP31  13.59,12.19 0 top
TP32  13.59,2.19 0 top
TP33  16.13,12.19 0 top
TP34  23.75,14.69 180 top
TP35  3.43,14.69 180 top
TP36  5.97,14.69 180 top
TP37  18.67,12.19 180 top
TP38  8.51,14.69 180 top
TP39  21.21,14.69 180 top
TP40  21.21,2.19 180 top
TP41  42.01,25.2 0 top
TP42  11.05,14.69 180 top
TP43  3.43,12.19 180 top
TP44  5.97,4.7 0 top
TP45  5.97,2.19 0 top
TP46  13.59,14.69 180 top
TP47  3.43,9.69 180 top
TP48  21.21,4.69 180 top
TP50  16.13,14.69 180 top
TP51  21.21,9.69 180 top
TP52  26.29,2.19 0 top
TP53  18.67,14.69 180 top
TP54  21.21,12.19 180 top
TP55  18.67,9.69 180 top
TP56  26.29,4.69 0 top
TP58  16.13,2.19 180 top
TP59  23.75,7.19 0 top
TP60  28.83,12.19 0 top
TP62  23.75,4.69 0 top
TP63  26.29,12.19 0 top
TP65  23.75,2.19 0 top
TP66  28.83,9.69 0 top
TP68  26.29,7.19 0 top
TP69  26.29,9.69 0 top
TP70  28.83,14.69 0 top
TP71  23.75,9.69 0 top
TP72  28.83,7.19 0 top
TP73  26.29,14.69 0 top
TP74  23.75,12.19 0 top
U1  27.5,38 0 top
U3  33.4,45.7 90 top
U8  26,26.9 270 top
U$1  34.3,27.11 180 top
U$2  [SENSYTHING]  44.7,31.6 0 bottom
U$3  38.14,8.69 0 top
U$4  [SENSYTHING_SMALL]  6.9,47.8 0 top
U$6  [LOGO-PROTY]  30,50.1 0 top
U$9  14.8,23.5 0 top
U$13  35.1,31.51 90 top
U$15  41.81,22.4 270 top
U$22  37.9,15 0 bottom
U$26  PROTY_LOGO_WITH_TEXT  [PROTY_WITH_TEXT@1]  38,50 0 bottom
Y1  8.03,40.51 270 top

### Tracks (layer width: path | path; a pad name or v marks a point on that pad's centre or on a via)
0  (via drill 0.3)
  Top 0.305: Q1.6 25.45,32.35 v25.1,32.7 | IC1.23 9.35,33.95 v8.9,33.5
  Top 0.406: R11.1 8.38,32.98 v8.9,33.5
  Bottom 0.305: v25.1,32.7 22.9,30.5 19.2,30.5 17,28.3 10.9,28.3 9.45,29.75 9.1,30.1 8.9,30.3 v8.9,33.5
3.3V  (via drill 0.3)
  Top 0.152: 9.75,25.55 v9.7,25.5
  Top 0.2: IC1.37 16.95,33.35 v17.6,32.7 | IC1.43 18.6,36.45 18.6,36.75 C15.1 18.75,37.85 v18.5,38.1 | v14.8,40.8 14.85,40.55 IC1.4 IC1.3 | IC1.1 16.75,39.55 v17.2,40 C11.1 18.65,38.25 v18.5,38.1 | IC1.46 18.35,37.95 v18.5,38.1 | R19.2 1.85,47.55 v1.9,47.6
  Top 0.254: U8.5 C67.1 | U$3.8 38.14,12.71 C17.2 | IC1.19 7.45,35.95 v6.8,36.6 | R8.2 20.52,29.58 v19.7,29.6 19.3,29.2 19.3,25.9
  Top 0.305: C67.1 30.75,27.85 31.4,27.2 31.4,25.4 32.4,24.4 32.4,15.85 R6.2 | U8.5 27.3,28.6 v27.5,28.8 | v6.8,36.6 6.6,36.8 J4.2 4.3,36.8 4.1,37 4.1,39.35 R4.2 | C9.1 19.95,25.25 19.3,25.9 | R18.2 R5.2 9.75,25.55 | R3.2 6.66,31.55 R11.2
  Top 0.406: R6.2 R7.2 35.65,14.5 36.2,14.5 36.9,13.8 C17.2 C16.2 | C9.1 19.45,24.2 U$9.13 16.2,24.2 v15.3,25.1 | J1.2 6.1,28.7 v6.6,29.2 6.93,29.53 R11.2
  Bottom 0.2: v17.6,32.7 17.6,37.2 v18.5,38.1 | v17.2,40 16.4,39.2 15.2,39.2 14.85,39.55 14.85,40.55 v14.8,40.8 | v6.8,36.6 6.6,36.8 J4.2 1.7,40.4 1.7,47.4 v1.9,47.6
  Bottom 0.254: v17.6,32.7 18.2,33.3 20.7,33.3 21.5,34.1 25.8,34.1 27.5,32.4 v27.5,28.8 20.5,28.8 v19.7,29.6
  Bottom 0.406: SV3.9 8.51,24.09 7.1,25.5 | 7.1,25.5 6.4,26.2 6.4,29 v6.6,29.2 6.8,29.4 v6.8,36.6 | v15.3,25.1 14.9,25.5 v9.7,25.5 7.1,25.5
3.3V_F  (via drill 0.3)
  Top 0.406: C62.1 29.09,42.44 U1.13 U1.14 28.45,37.75 v27.7,37 | U1.3 25.91,36.29 v25.6,36.6
  Bottom 0.406: v27.7,37 26,37 v25.6,36.6
32K_XN
  Top 0.305: IC1.13 8.34,38.95 Y1.P$2 6.41,39.26 C58.2
32K_XP
  Top 0.254: Y1.P$1 8.34,41.76 | C57.2 8.3,42.04 Y1.P$1 | IC1.12 10.09,39.7 Y1.P$1
!CS1
  Top 0.254: U$9.2 11,25.5 10.5,26 10.5,29 10.9,29.4 11.4,29.9 11.85,30.35 IC1.27
!DRDY  (via drill 0.3)
  Top 0.2: IC1.25 10.85,31.55 v11,31.4
  Top 0.254: U$9.14 16.66,24.84 14.8,26.7 v14.8,29.3
  Bottom 0.254: v11,31.4 12.7,31.4 v14.8,29.3
+5V  (via drill 0.3)
  Top 0.254: U$15.1 37.52,23.38 R39.2 35.9,23.25 C3.1
  Top 0.406: v15.2,23.6 15.26,23.54 U$9.12 20.41,23.54 C10.1 21.25,21.85 21.6,21.5 v28.8,21.5 | C3.1 34,22.95 C4.1 v33.9,24
  Bottom 0.406: v15.2,23.6 13.7,23.6 11.05,20.95 SV3.8 | v28.8,21.5 31.4,21.5 v33.9,24
AGND
  pour Top: 0,23.6 30.5,23.6 30.5,0 0,0
  pour Bottom: 0,23.6 30.5,23.6 30.5,0 0,0
AIN0
  Top 0.254: U$9.11 19,22.91 20,21.9 20,21.3 20.4,20.9 26.04,20.9 SV3.1
AIN1
  Top 0.254: U$9.10 18.76,22.24 19.4,21.6 19.4,20.8 19.9,20.3 24.1,20.3 SV3.2
AIN2  (via drill 0.3)
  Top 0.254: U$9.7 14.26,22.24 v14.6,21.9
  Bottom 0.254: v14.6,21.9 19.96,21.9 SV3.3
AIN3  (via drill 0.3)
  Top 0.254: U$9.6 14.7,22.91 15.7,21.9 v15.7,21
  Bottom 0.254: v15.7,21 18.32,21 SV3.4
BAT_MON
  Top 0.2: R25.1 R26.2 11.7,43.65 11.7,42.4 13,41.1 13,41 13.5,40.5 14.1,40.5 14.3,40.3 14.35,40.25 IC1.5 14.35,39.95
BUTTON  (via drill 0.3)
  Top 0.2: IC1.16 8.25,37.45 8.1,37.3 7.4,37.3 v6.6,38.1
  Top 0.305: 6.8,37.9 v6.6,38.1 | SW2.B' v3.1,42.8 SW2.B 3.1,46.45 R19.1
  Bottom 0.305: v3.1,42.8 3.1,41.6 v6.6,38.1
CHIP_PU  (via drill 0.3)
  Top 0.2: IC1.9 12.35,40.55 v11.8,41.3
  Top 0.254: Q1.3 26.75,29.15 26.4,28.8 22.8,28.8 22.22,29.38 | R8.1 22.22,29.38 | 22.22,29.38 22.22,30.18 21.1,31.3 v20.2,31.3
  Bottom 0.254: v11.8,41.3 10.1,39.2 10.1,34.2 11.6,32.7 12.7,32.7 14.6,30.8 18.3,30.8 18.8,31.3 v20.2,31.3
CIN1
  Top 0.254: U$3.2 37.64,5.64 37.3,5.3 35.6,5.3 34.69,4.39 SV1.5
CIN2
  Top 0.254: U$3.3 38.14,5.34 37.23,4.43 SV1.4
CIN3
  Top 0.254: SV1.3 39.77,4.43 38.64,5.56 U$3.4
CIN4
  Top 0.254: U$3.5 40.51,6.49 42.31,4.69 SV1.2
D+
  Top 0.254: 34.05,37.85 R15.1 34.4,38.25 JP7.3
D-
  Top 0.254: JP7.2 36.2,37.6 35.45,36.85 35.3,36.7 35.2,36.6 R14.1
DC/DC_EN  (via drill 0.3)
  Top 0.254: IC1.39 18.15,34.45 19.3,33.3 21.6,33.3 22.8,34.5 22.8,35.4 v23.1,35.7 | U$13.6 34.17,30.07 v34.1,30
  Bottom 0.254: v34.1,30 28.4,35.7 v23.1,35.7
DTR
  Top 0.254: U1.1 24.64,34.04 23.2,32.6 23.2,30.73 R9.1 24.41,29.72 Q1.1
EN  (via drill 0.3)
  Top 0.406: S2.2 43.55,29.35 v43.3,29.1 | U8.3 25.85,25.95 v26,26.1
  Bottom 0.406: v43.3,29.1 29.3,29.1 28.2,28 25.3,28 25,27.7 25,26.5 25.4,26.1 v26,26.1
FDC_SCL  (via drill 0.3)
  Top 0.2: IC1.18 9.15,36.45 v8.9,36.7
  Top 0.254: 35.85,12.4 R7.1 | U$3.9 37.64,11.86 v37.2,12.3
  Top 0.305: 35.85,12.4 37.1,12.4 v37.2,12.3
  Bottom 0.2: v37.2,12.3 37.2,24.4 36.2,25.4 24.8,25.4 22.4,27.8 10.7,27.8 8.2,30.3 8.2,35 8.4,35.2 8.4,36.2 v8.9,36.7
FDC_SDA  (via drill 0.3)
  Top 0.254: IC1.34 15.35,31.95 11.6,28.2 v11.6,27 | R6.1 33.6,11.8 34.5,10.9 v35.4,10.9
  Top 0.305: U$3.10 v35.41,10.89 v35.4,10.9
  Bottom 0.254: v11.6,27 22.5,27 24.6,24.9 35.8,24.9 36.4,24.3 36.4,11.9 v35.4,10.9
GND  (via drill 0.3)
  Top 0.178: 12.51,48.73 10.31,48.73
  Top 0.254: U$3.7 38.64,12.89 C17.1 | U8.2 23.35,26.9 C72.1 | U$9.4 U$9.3
  Top 0.406: U$13.3 36.02,33.02 C60.2
  Top 0.762: E1.GND 12.51,48.73 | 10.31,48.73 E1.GND2
  other vias: 11.8,36.13 13.61,36.2 11.78,38.2 15.35,36.13 15.45,34.27 13.68,34.27 11.9,34.37 10.13,48.94 8.86,48.94 7.59,48.94 6.32,48.94 5.05,48.94 3.78,48.94 11.4,48.94 12.67,48.94 14.7,48.94 15.97,48.94 17.24,48.94 18.51,48.94 19.78,48.94 21.05,48.94 22.32,48.94 23.59,48.94 26.13,48.94 27.4,48.94 13.05,48.02 15.46,48.02 14.07,45.89 16.61,45.89 15.97,46.78 14.32,44.62 16.48,44.62 14.32,43.35 16.48,43.35 16.58,42.08 16.78,41.01 18.96,41.34 13.05,44.62 13.05,43.35 13.05,45.79 11.4,47.67 10.13,47.67 8.86,47.67 16.73,47.92 17.24,46.78 17.88,45.89 17.75,44.62 17.75,43.35 17.75,42.08 18.51,47.67 19.78,47.67 21.05,47.67 22.32,47.67 23.59,47.67 13.66,38.13 12.47,42.62 15.35,38.1 3.3,32.1 30.2,26.1 0.9,42.9 22,32.3 41,29.9 30.3,30.6 38,35.5 23.8,34.9 4.9,38.7
  pour Bottom (isolate 0.305, rank 6): 47,49.3 47,11.9 38.9,11.9 38.9,9 31.5,9 31.5,24.5 -0.1,24.5 0,49.3
  pour Top (isolate 0.305, rank 6): -0.1,24.5 31.5,24.5 31.5,9 38.9,9 38.9,11.9 47,11.9 47,49.3 0,49.3
LED1
  Top 0.2: IC1.42 21.15,35.95 21.4,36.2 21.4,42.15 D3.C
LED2  (via drill 0.3)
  Top 0.2: IC1.15 7.85,37.95 v7.7,38.1 | D2.C 4.65,42.95 v3.9,42.2
  Bottom 0.2: v7.7,38.1 7.7,38.4 v3.9,42.2
LNA_IN
  Top 0.2: IC1.2 15.85,40.65 15.9,40.7
  Top 0.305: 15.41,41.84 L1.1
  Top 0.61: L1.1 15.9,41.35 15.9,40.7
  Top 0.762: 15.41,41.84 C49.1
MISO
  Top 0.2: IC1.38 17.85,33.95 18.3,33.5
  Top 0.254: U$9.15 18.4,25.5 18.7,25.8 18.7,33.1 18.3,33.5
MOSI
  Top 0.254: U$9.16 17.34,26.16 16.35,27.15 IC1.36
N$3
  Top 0.2: R1.2 20.55,44.5 D3.A
N$4
  Top 0.254: Q1.5 26.1,31.2 25.7,30.8 24.83,30.8 R9.2
N$5
  Top 0.2: D2.A 4.9,45.65 R2.2
N$8
  Top 0.254: IC1.24 10.1,31.2 TP1.TP
N$9
  Top 0.254: Q1.2 26.1,30.3 26.3,30.5 27.93,30.5 R10.2
N$20
  Top 0.254: R14.2 31.7,36.6 29.72,38.58 U1.12
N$21
  Top 0.254: R15.2 31.4,37.9 30.36,38.94 U1.11
N$22
  Top 0.406: U3.1 34.7,43.85 CHG2.C
N$25
  Top 0.254: U$13.2 37.46,31.51 R20.2 37.85,33.7 R21.1
N$26
  Top 0.254: U$15.6 45.48,22.07 C45.1
N$27
  Top 0.254: U$15.2 38.83,22.73 37.45,21.35 R39.1 | R40.2 37.35,21.3 R39.1 | R39.1 35.9,21.35 C3.2
N$29
  Top 0.406: CHG2.A R16.2
N$31
  Top 0.406: R17.2 31.45,44.1 U3.5
N$39
  Top 0.254: U$13.5 33.21,31.51 32.7,31
  Top 1.016: 32.7,31 U$1.P$2
REFN0  (via drill 0.3)
  Top 0.254: U$9.8 13.52,21.58 v14.4,20.7
  Bottom 0.254: v14.4,20.7 14.9,20.2 16.58,20.2 SV3.5
REFP0
  Top 0.254: U$9.9 17.62,19.6 SV3.6
RTS
  Top 0.254: U1.2 25.28,34.62 26.75,33.15 Q1.4 28.49,31.56 R10.1
RXD
  Top 0.254: U1.4 26.55,36.75 25.9,37.4 23.7,37.4 22.3,36 22.3,34.95 R13.2
SCL
  Top 0.254: IC1.22 5.65,34.45 J4.4
  Top 0.305: R3.1 5.7,34.4 J4.4
SCL_1  (via drill 0.3)
  Top 0.2: v10.8,42.7 10.8,41.3 11.5,40.6 11.6,40.6 11.85,40.35 IC1.10
  Top 0.305: J1.4 7.1,26.7 v7.2,26.8 7.3,26.7 R5.1
  Bottom 0.2: v10.8,42.7 9.7,42.7 8.4,41.4 8.4,37.8 7.6,37 7.6,35.8 7.4,35.6 7.4,27.4
  Bottom 0.305: 7.4,27.4 7.4,27 v7.2,26.8
SCLK
  Top 0.254: IC1.35 15.85,31.55 12.9,28.6 12.9,27.07 U$9.1
SDA
  Top 0.254: IC1.21 7.45,34.95 6.6,35.8 J4.3
  Top 0.305: J4.3 4,35.8 3.5,36.3 3.5,39.6 4,40.1 4,40.9 4.55,41.45 R4.1
SDA_1  (via drill 0.3)
  Top 0.2: J1.3 6.9,27.7 v8.3,29.1 | IC1.11 11.35,40.25 10.1,41.5 v10.1,41.8
  Top 0.305: R18.1 8.45,28.95 v8.3,29.1
  Bottom 0.2: v8.3,29.1 8.2,29.1 7.8,29.5 7.8,35.3 8,35.5 8,36.8 8.8,37.6 8.8,40.5 v10.1,41.8
SHLD1  (via drill 0.3)
  Top 0.254: U$3.1 33.99,6.49 32.15,4.65 SV1.6 | 36,0.9 36,4.4 v36.1,4.5 36.4,4.8 36.8,4.8 | 38.5,4.9 v38.5,4.5 38.5,0.9
  pour Bottom: 31.5,6.9 36.7,6.9 40.7,3.7 40.7,0 31.5,0
SHLD2  (via drill 0.3)
  Top 0.254: U$3.6 39.14,9.16 44.85,3.45 SV1.1 | 39.2,5.6 40.2,5.6 40.9,4.9 v41,4.9 41,1.1
  pour Bottom: 38.8,6.5 38.7,7.8 39.6,7.8 39.6,10.9 47,10.9 47,0 41.6,0 41.6,3.7
TRACE_ANT2
  Top 0.178: E1.ANT 13.69,49.12
  Top 0.762: 13.69,49.12 arc46 14.22,47.95 arc-35 C48.1 arc33 15.26,45.89 arc-37 15.39,45.58 15.39,45.24 C49.2
TXD
  Top 0.254: U1.20 24.64,42.19 R12.2
U0RXD  (via drill 0.3)
  Top 0.254: IC1.40 18.45,34.95 19.3,34.1 v20.1,34.1 | R12.1 23.15,40.65 v23,40.5
  Bottom 0.254: v20.1,34.1 20.1,37.6 v23,40.5
U0TXD
  Top 0.254: IC1.41 20.5,35.45 R13.1
VBAT  (via drill 0.3)
  Top 0.305: R25.2 v7.3,46.2
  Top 0.406: C65.1 34.7,48.15 U3.3 36.15,46.65 v36.4,46.9 38.4,46.9 | JP6.2 38.4,46.9 | Q2.3 38.3,46.8 38.4,46.9
  Bottom 0.2: v7.3,46.2 9.3,46.2 11.6,43.9 11.6,42.5 13.2,40.9 13.2,40.4 14.8,38.8 19.1,38.8 29,48.7 34.6,48.7 v36.4,46.9
VCC  (via drill 0.3)
  Top 0.254: C44.1 43.97,19.52 U$15.5 43.97,20.53 v44,20.5 | U$15.8 43.97,24.47 v44.1,24.3 | U$13.4 32.79,32.16 C83.1
  Top 0.406: U$13.4 34.17,32.92 v34.1,33 | R20.1 41.1,31.9 v41.2,31.8 42.01,30.99 TP41.TP 42.74,24.47 43.97,24.47
  Bottom 0.254: v44.1,24.3 44.1,20.6 v44,20.5
  Bottom 0.406: v41.2,31.8 40,33 v34.1,33
VIN  (via drill 0.3)
  Top 0.254: C1.1 36.79,30.86 U$13.1 35.9,30.73 35.9,30 | U8.1 23,27.85 C72.2
  Top 0.406: C63.1 40.75,39.3 D1.C 39.55,40.35 v39.3,40.6 39.25,40.65 Q2.2 | C1.1 37.75,29.15 39.2,27.7 v41,27.7 | U$1.P$1 37.09,27.11 v37.2,27 | S2.3 43.55,27.75 v43.3,28 | U8.1 25.35,27.85 v26,27.2
  Top 1.016: U$1.P$1 35.9,30
  Bottom 0.406: v41,27.7 41.3,28 v43.3,28 44,28 44.4,28.4 44.4,30.5 39.3,35.6 v39.3,40.6 | v37.2,27 26.7,26.9 26.3,26.9 v26,27.2
VUSB  (via drill 0.3)
  Top 0.406: 35.85,39.3 D1.A 37.25,40.55 v37.3,40.6 37.35,40.65 Q2.1 | 35.85,39.3 R23.2 | U1.15 27.82,42.03 C61.1 26.25,42.45 v25.7,43 | 30.2,46.65 v30.2,47.9 | U3.4 30.2,46.65 | 30.2,46.65 C64.1 | 35.85,39.3 33.1,39.3 31.35,41.05 R16.1 30.3,42.1 v30.2,42.2 | JP7.1 37.25,36.95 v36.9,36.6 35.5,35.2 C60.1
  Bottom 0.406: v30.2,47.9 v30.2,42.2 26.5,42.2 v25.7,43 | v37.3,40.6 37.3,37 v36.9,36.6

### Text on the board
tPlace: D3 | R17 | D2 | ON | GND | 3.3V | 5V | RP0 | RN0 | A4 | A3 | A2 | A1 | sensything v1 | CIN1 | CIN2 | CIN3 | SHLD1 | CIN4 | SHLD2
bPlace: protocentral.com | BATTERY / LI-ION / 3.7V | QWIIC2 | QWIIC1 | sensything v1